# Altium schematic sheet INPUTS_OUTPUTS.SchDoc
size A3
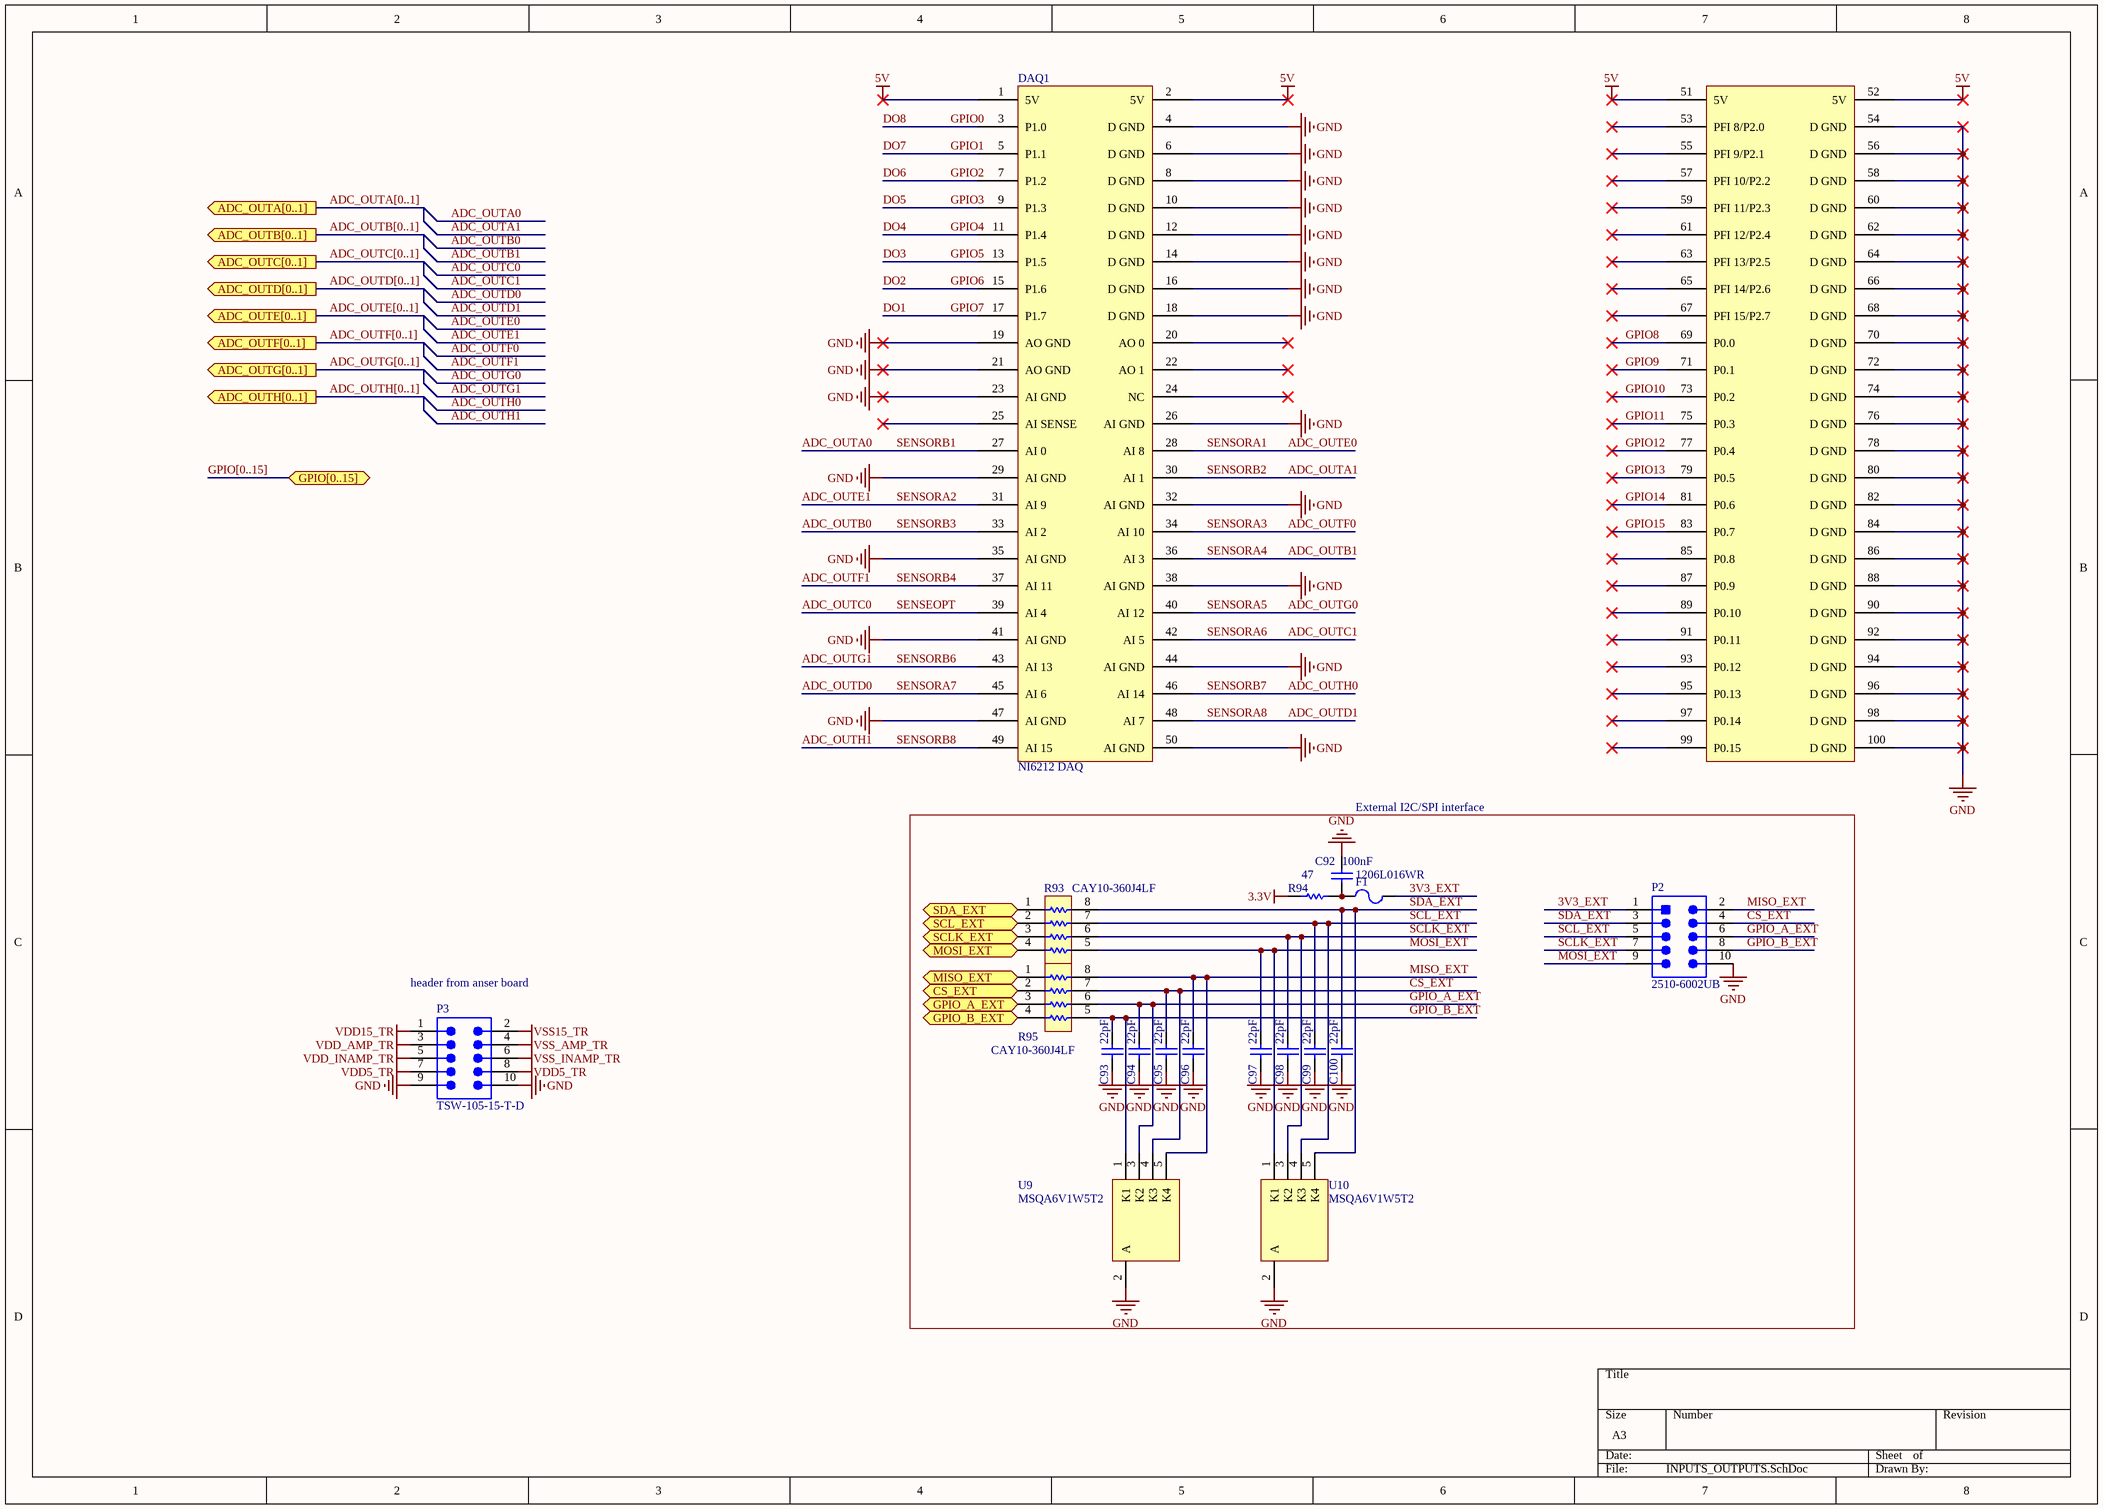
[diagram p0: INPUTS_OUTPUTS.SchDoc]

## Parts
C92  value 100nF  [CAPC0402(1005)60_L]  (hidden comment: CAP0402)
C93  value 22pF  [CAPC0402(1005)60_L]  (hidden comment: CAP0402)
C94  value 22pF  [CAPC0402(1005)60_L]  (hidden comment: CAP0402)
C95  value 22pF  [CAPC0402(1005)60_L]  (hidden comment: CAP0402)
C96  value 22pF  [CAPC0402(1005)60_L]  (hidden comment: CAP0402)
C97  value 22pF  [CAPC0402(1005)60_L]  (hidden comment: CAP0402)
C98  value 22pF  [CAPC0402(1005)60_L]  (hidden comment: CAP0402)
C99  value 22pF  [CAPC0402(1005)60_L]  (hidden comment: CAP0402)
C100  value 22pF  [CAPC0402(1005)60_L]  (hidden comment: CAP0402)
DAQ1  NI6212 DAQ  [OUTPUT_CONNECTORS]
F1  1206L016WR  [LFUS-1206L016WR_V]
P2  2510-6002UB  [3M-2510-6002_V]
P3  TSW-105-15-T-D  [SMTC-TSW-105-15-X-D]
R93  CAY10-360J4LF  [BOUR-CAY10-J4_V]
R94  value 47  [RESC0402(1005)_L]  (hidden comment: RES0402)
R95  CAY10-360J4LF  [BOUR-CAY10-J4_V]
U9  MSQA6V1W5T2  [ONSC-SC70-5-419A-02_V]
U10  MSQA6V1W5T2  [ONSC-SC70-5-419A-02_V]

## Blocks framed on the sheet
External I2C/SPI interface: C92-C100 F1 P2 R93-R95 U9 U10

## Ports
ADC_OUTA[0..1] (out), ADC_OUTB[0..1] (out), ADC_OUTC[0..1] (out), ADC_OUTD[0..1] (out), ADC_OUTE[0..1] (out), ADC_OUTF[0..1] (out), ADC_OUTG[0..1] (out), ADC_OUTH[0..1] (out), CS_EXT, GPIO[0..15] (bidir), GPIO_A_EXT, GPIO_B_EXT, MISO_EXT (in), MOSI_EXT (out), SCL_EXT (out), SCLK_EXT (out), SDA_EXT (bidir)

## Nets
3.3V: R94.1
5V: DAQ1.1(5V) DAQ1.2(5V) DAQ1.51(5V) DAQ1.52(5V)
GND: C92.1 C93.2 C94.2 C95.2 C96.2 C97.2 C98.2 C99.2 C100.2 DAQ1.4(D_GND) DAQ1.6(D_GND) DAQ1.8(D_GND) DAQ1.10(D_GND) DAQ1.12(D_GND) DAQ1.14(D_GND) DAQ1.16(D_GND) DAQ1.18(D_GND) DAQ1.19(AO_GND) DAQ1.21(AO_GND) DAQ1.23(AI_GND) DAQ1.26(AI_GND) DAQ1.29(AI_GND) DAQ1.32(AI_GND) DAQ1.35(AI_GND) DAQ1.38(AI_GND) DAQ1.41(AI_GND) DAQ1.44(AI_GND) DAQ1.47(AI_GND) DAQ1.50(AI_GND) DAQ1.54(D_GND) DAQ1.56(D_GND) DAQ1.58(D_GND) DAQ1.60(D_GND) DAQ1.62(D_GND) DAQ1.64(D_GND) DAQ1.66(D_GND) DAQ1.68(D_GND) DAQ1.70(D_GND) DAQ1.72(D_GND) DAQ1.74(D_GND) DAQ1.76(D_GND) DAQ1.78(D_GND) DAQ1.80(D_GND) DAQ1.82(D_GND) DAQ1.84(D_GND) DAQ1.86(D_GND) DAQ1.88(D_GND) DAQ1.90(D_GND) DAQ1.92(D_GND) DAQ1.94(D_GND) DAQ1.96(D_GND) DAQ1.98(D_GND) DAQ1.100(D_GND) P2.10 P3.9 P3.10 U9.2(A) U10.2(A)
VDD5_TR: P3.7 P3.8
VDD15_TR: P3.1
VDD_AMP_TR: P3.3
VDD_INAMP_TR: P3.5
VSS15_TR: P3.2
VSS_AMP_TR: P3.4
VSS_INAMP_TR: P3.6
3V3_EXT: F1.2 P2.1
ADC_OUTA0: DAQ1.27(AI_0)  [also labelled SENSORB1]
ADC_OUTA1: DAQ1.30(AI_1)  [also labelled SENSORB2]
ADC_OUTB0: DAQ1.33(AI_2)  [also labelled SENSORB3]
ADC_OUTB1: DAQ1.36(AI_3)  [also labelled SENSORA4]
ADC_OUTC0: DAQ1.39(AI_4)  [also labelled SENSEOPT]
ADC_OUTC1: DAQ1.42(AI_5)  [also labelled SENSORA6]
ADC_OUTD0: DAQ1.45(AI_6)  [also labelled SENSORA7]
ADC_OUTD1: DAQ1.48(AI_7)  [also labelled SENSORA8]
ADC_OUTE0: DAQ1.28(AI_8)  [also labelled SENSORA1]
ADC_OUTE1: DAQ1.31(AI_9)  [also labelled SENSORA2]
ADC_OUTF0: DAQ1.34(AI_10)  [also labelled SENSORA3]
ADC_OUTF1: DAQ1.37(AI_11)  [also labelled SENSORB4]
ADC_OUTG0: DAQ1.40(AI_12)  [also labelled SENSORA5]
ADC_OUTG1: DAQ1.43(AI_13)  [also labelled SENSORB6]
ADC_OUTH0: DAQ1.46(AI_14)  [also labelled SENSORB7]
ADC_OUTH1: DAQ1.49(AI_15)  [also labelled SENSORB8]
CS_EXT: C95.1 P2.4 R95.7 U9.4(K3)
CS_EXT: R95.2 ; port CS_EXT  [a separate net that carries the same name]
DO1: DAQ1.17(P1.7)  [also labelled GPIO7]
DO2: DAQ1.15(P1.6)  [also labelled GPIO6]
DO3: DAQ1.13(P1.5)  [also labelled GPIO5]
DO4: DAQ1.11(P1.4)  [also labelled GPIO4]
DO5: DAQ1.9(P1.3)  [also labelled GPIO3]
DO6: DAQ1.7(P1.2)  [also labelled GPIO2]
DO7: DAQ1.5(P1.1)  [also labelled GPIO1]
DO8: DAQ1.3(P1.0)  [also labelled GPIO0]
GPIO8: DAQ1.69(P0.0)
GPIO9: DAQ1.71(P0.1)
GPIO10: DAQ1.73(P0.2)
GPIO11: DAQ1.75(P0.3)
GPIO12: DAQ1.77(P0.4)
GPIO13: DAQ1.79(P0.5)
GPIO14: DAQ1.81(P0.6)
GPIO15: DAQ1.83(P0.7)
GPIO_A_EXT: C94.1 P2.6 R95.6 U9.3(K2)
GPIO_A_EXT: R95.3 ; port GPIO_A_EXT  [a separate net that carries the same name]
GPIO_B_EXT: C93.1 P2.8 R95.5 U9.1(K1)
GPIO_B_EXT: R95.4 ; port GPIO_B_EXT  [a separate net that carries the same name]
MISO_EXT: C96.1 P2.2 R95.8 U9.5(K4)
MISO_EXT: R95.1 ; port MISO_EXT  [a separate net that carries the same name]
MOSI_EXT: C97.1 P2.9 R93.5 U10.1(K1)
MOSI_EXT: R93.4 ; port MOSI_EXT  [a separate net that carries the same name]
SCL_EXT: C99.1 P2.5 R93.7 U10.4(K3)
SCL_EXT: R93.2 ; port SCL_EXT  [a separate net that carries the same name]
SCLK_EXT: C98.1 P2.7 R93.6 U10.3(K2)
SCLK_EXT: R93.3 ; port SCLK_EXT  [a separate net that carries the same name]
SDA_EXT: C100.1 P2.3 R93.8 U10.5(K4)
SDA_EXT: R93.1 ; port SDA_EXT  [a separate net that carries the same name]
NetC92_2: C92.2 F1.1 R94.2

Not connected (* = marked no-connect by the designer): DAQ1 20(AO_0)* 22(AO_1)* 24(NC)* 25(AI_SENSE)* 53(PFI_8/P2.0)* 55(PFI_9/P2.1)* 57(PFI_10/P2.2)* 59(PFI_11/P2.3)* 61(PFI_12/P2.4)* 63(PFI_13/P2.5)* 65(PFI_14/P2.6)* 67(PFI_15/P2.7)* 85(P0.8)* 87(P0.9)* 89(P0.10)* 91(P0.11)* 93(P0.12)* 95(P0.13)* 97(P0.14)* 99(P0.15)*

## Buses and harness runs
bus ADC_OUTA[0..1] = port ADC_OUTA[0..1]
bus ADC_OUTB[0..1] = port ADC_OUTB[0..1]
bus ADC_OUTC[0..1] = port ADC_OUTC[0..1]
bus ADC_OUTD[0..1] = port ADC_OUTD[0..1]
bus ADC_OUTE[0..1] = port ADC_OUTE[0..1]
bus ADC_OUTF[0..1] = port ADC_OUTF[0..1]
bus ADC_OUTG[0..1] = port ADC_OUTG[0..1]
bus ADC_OUTH[0..1] = port ADC_OUTH[0..1]
bus GPIO[0..15] = port GPIO[0..15]

## Notes on the sheet
- (near P3) header from anser board

## Library data of the parts
C92-C100 = CMP-1590-00004-1: 0402 (1005 Metric) Chip Capacitor; Case-EIA: 0402; Case-Metric: 1005; PackageReference: CAPC0402(1005)60
DAQ1 = NI6212_OUTPUT_CONNECTIONS: DAQ Unit; Published: 8-Jun-2000; Publisher: National Instruments
F1 = CMP-2000-05471-1: Resettable Fuse, 30 V, 100 A, 4.5 Ohm, -40 to 85 degC, 1206 (3216 Metric), RoHS, Tape and Reel; Manufacturer: Littelfuse; Hold Current [Ih]: 0.16A; Trip Current: 0.37A; Working Voltage-Max: 30V; Datasheet Version: 08/2016; Size: 1206; Manufacturer URL: http://www.littelfuse.com/; Datasheet URL: http://www.littelfuse.com/~/media/electronics/datasheets/resettable_ptcs/littelfuse_ptc_1206l_datasheet.pdf.pdf; Mounting Technology: SurfaceMount; Package Reference: 1206L016WR; Package Description: 2-Pin Surface Mount Device, Body 3.2 x 1.65 mm, Height 1.45 mm (Max); Operating Temp Range: -40to+85°C
P2 = CMP-2000-05545-1: Male Header, Pitch 2.54 mm, 2 x 5 Position, Height 9.91 mm, Tail Length 2.84 mm, -55 to 105 degC, RoHS, Bulk; Manufacturer: 3M; Associated Product: 3505-33(1000BX)-ND / -CONNEJECTORLATCHLONGSNAP-IN; Pitch: 0.100"(2.54mm); Catalog Drawings: 6002UB,RBSeries; Dynamic Catalog: 2500Series; Connector Type: Header,Shrouded; Other Names: 5400782713 / 54007827139 / 80-6105-6503-0 / 80610565030 / MHB10G / MHB10K; Product Training Modules: IDCWiremountConnectorsPrimer; Number of Positions Loaded: All; Mating Products: CHG-2010-S01010-KEP-ND / -CONNRCPTIDC10POS24-22AWG / 3M11964-ND / -CONNSOCKET10POSIDCW/STRREL / 89110-0003-ND / -CONNSOCKET10POSIDCW/STRREL / 5110-B7A2PL-ND / -10/2R/BMSKT/.100 / MKC10E-ND / -CONN10POSIDCSOCKET10AUW/POL / MSC10E-ND / -CONN10POSIDCSOCKET15GOLD / D89110-0101HK-ND / -CONN10POSIDCSOCKETGOLDW/POL / D89110-0001HK-ND / -CONN10POSIDCSOCKETGOLD / MSPV10-ND / -CONNSOCKETPCBVERT10POS.1" / 3M9088-ND / -CONNRECEPTIDC10POS24-22AWG / More...; Number of Positions: 10; Category: Connectors,Interconnects; Datasheet Version: Rev. M, 08/2014; Datasheet URL: http://multimedia.3m.com/mws/media/330367O/3mtm-100-in-4-wall-hdr-rohs-lp-straightra-hitemp-ts0770.pdf; Series: 2500; Contact Finish: Gold; Number of Rows: 2; Standard Package: 784; Color: Gray; Package Description: Male Header, Pitch 2.54 mm, 2 x 5 Position, Height 9.91 mm, Tail Length 2.84 mm; Packaging: Bulk; Contact Type: MalePin; Mounting Technology: ThroughHole; Family: RectangularConnectors-Headers,MalePins; Contact Mating Length: 0.243"(6.17mm); Termination: Solder; Row Spacing: 0.100"(2.54mm); Package Reference: 2510-6002; Contact Finish Thickness: 30µin(0.76µm); Mounting Type: ThroughHole; Manufacturer URL: http://www.3m.com/
P3 = CMP-1024-00368-1: Manufacturer: Samtec; Pitch: 2.54 mm; DatasheetVersion: F-214; PackageDescription: .025[0.64] SQ. Post Terminal Strip Assembly; PartNumber: TSW-105-15-T-D; PackageReference: TSW-105-15-X-D; ComponentLink2URL: http://www.samtec.com/documents/webfiles/pdf/TSW_TH.PDF; ComponentLink1URL: http://www.samtec.com; ComponentLink2Description: Datasheet; ComponentLink3Description: Package Specification; PackageVersion: DM, 8/1988; Mounting Technology: Through-hole; Temperature Range: -55 to 105 degC; ComponentLink1Description: Manufacturer URL; RoHS: True; ComponentLink3URL: http://www.samtec.com/documents/webfiles/cpdf/TSW-XXX-XX-XXX-X-XX-XXX-MKT.pdf; Orientation: Vertical
R93 R95 = CMP-1734-00001-1: Chip Resistor Array, 36 Ohm, +/- 5%, 62.5 mW, -55 to 125 degC, 8-Pin SMD, RoHS, Tape and Reel; Power Rating: 120 mW; Resistance: 36 Ohm; Type (Resistor): Thick Film; ComponentLink1URL: http://www.bourns.com/; ComponentLink2Description: Datasheet; Height: 0.018 inch; Mounting Technology: Surface Mount; ComponentLink2URL: http://www.bourns.com/docs/Product-Datasheets/CAY10.pdf; PartNumber: CAY10-360J4LF; Case Code (Metric): 2010; ComponentLink1Description: Manufacturer URL; DatasheetVersion: 01/2015; Width: 0.039 inch; Packaging: Tape and Reel; Pins: 8; RoHSCompliant: true; Mount: Surface Mount; Package Quantity: 10000; Length: 0.079 inch; PackageDescription: 8-Pin Surface Mount Device, Body 2 x 1 mm, Pitch 0.5 mm; Max Operating Temperature: 125 degC; Min Operating Temperature: -55 degC; Case/Package: 0804; Tolerance: 5%
R94 = CMP-1591-00004-1: 0402 (1005 Metric) Chip Resistor; Case-EIA: 0402; Case-Metric: 1005; PackageReference: RESC0402(1005)
U9 U10 = CMP-1060-00060-1: Quad Array ESD Protection Diodes with Low Clamping Voltage, 5-Pin SC70, Tape and Reel; Manufacturer: On Semiconductor; P Max (W): 0.385; Packing: Tape and Reel; DatasheetVersion: Rev. 7; ComponentLink2URL: http://www.onsemi.com/pub_link/Collateral/MSQA6V1W5T2-D.PDF; PackageDescription: 5-Pin Small Outline Transistor, Body 2 x 1.25 mm, Pitch 0.65 mm; PackageVersion: Rev. L, 01/2013; ComponentLink1URL: http://www.onsemi.com/; ComponentLink2Description: Datasheet; ComponentLink3Description: Package Specification; Mounting Technology: Surface Mount; ComponentLink1Description: Manufacturer URL; PackageReference: SC70-5-419A-02; PartNumber: MSQA6V1W5T2; ComponentLink3URL: http://www.onsemi.cn/pub_link/Collateral/419A-02.PDF